# EAGLE design eeprom (EAGLE 7.5.0)
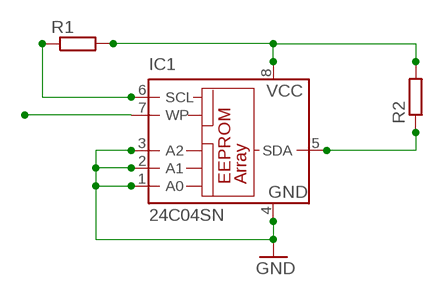
[diagram p0: schematic, sheet 1]

## Parts
IC1  24C04SN  [SO-08]
R1  R-EU_R2012W  [R2012W]
R2  R-EU_R2012W  [R2012W]

## Nets
GND: IC1.1(A0) IC1.2(A1) IC1.3(A2) IC1.4(GND)
N$1: IC1.8(VCC) R1.2 R2.2
N$2: IC1.6(SCL) R1.1
N$3: IC1.5(SDA) R2.1
N$4: IC1.7(WP)

## Library data of the parts
IC1 = microchip:24C*: Serial EEPROM 1 K/2 K/4 K; MPN: M24C04-WMN6P; OC_FARNELL: 9882812; OC_NEWARK: 83K1376
R1 R2 = resistor:R-EU_: RESISTOR, European symbol

## Board
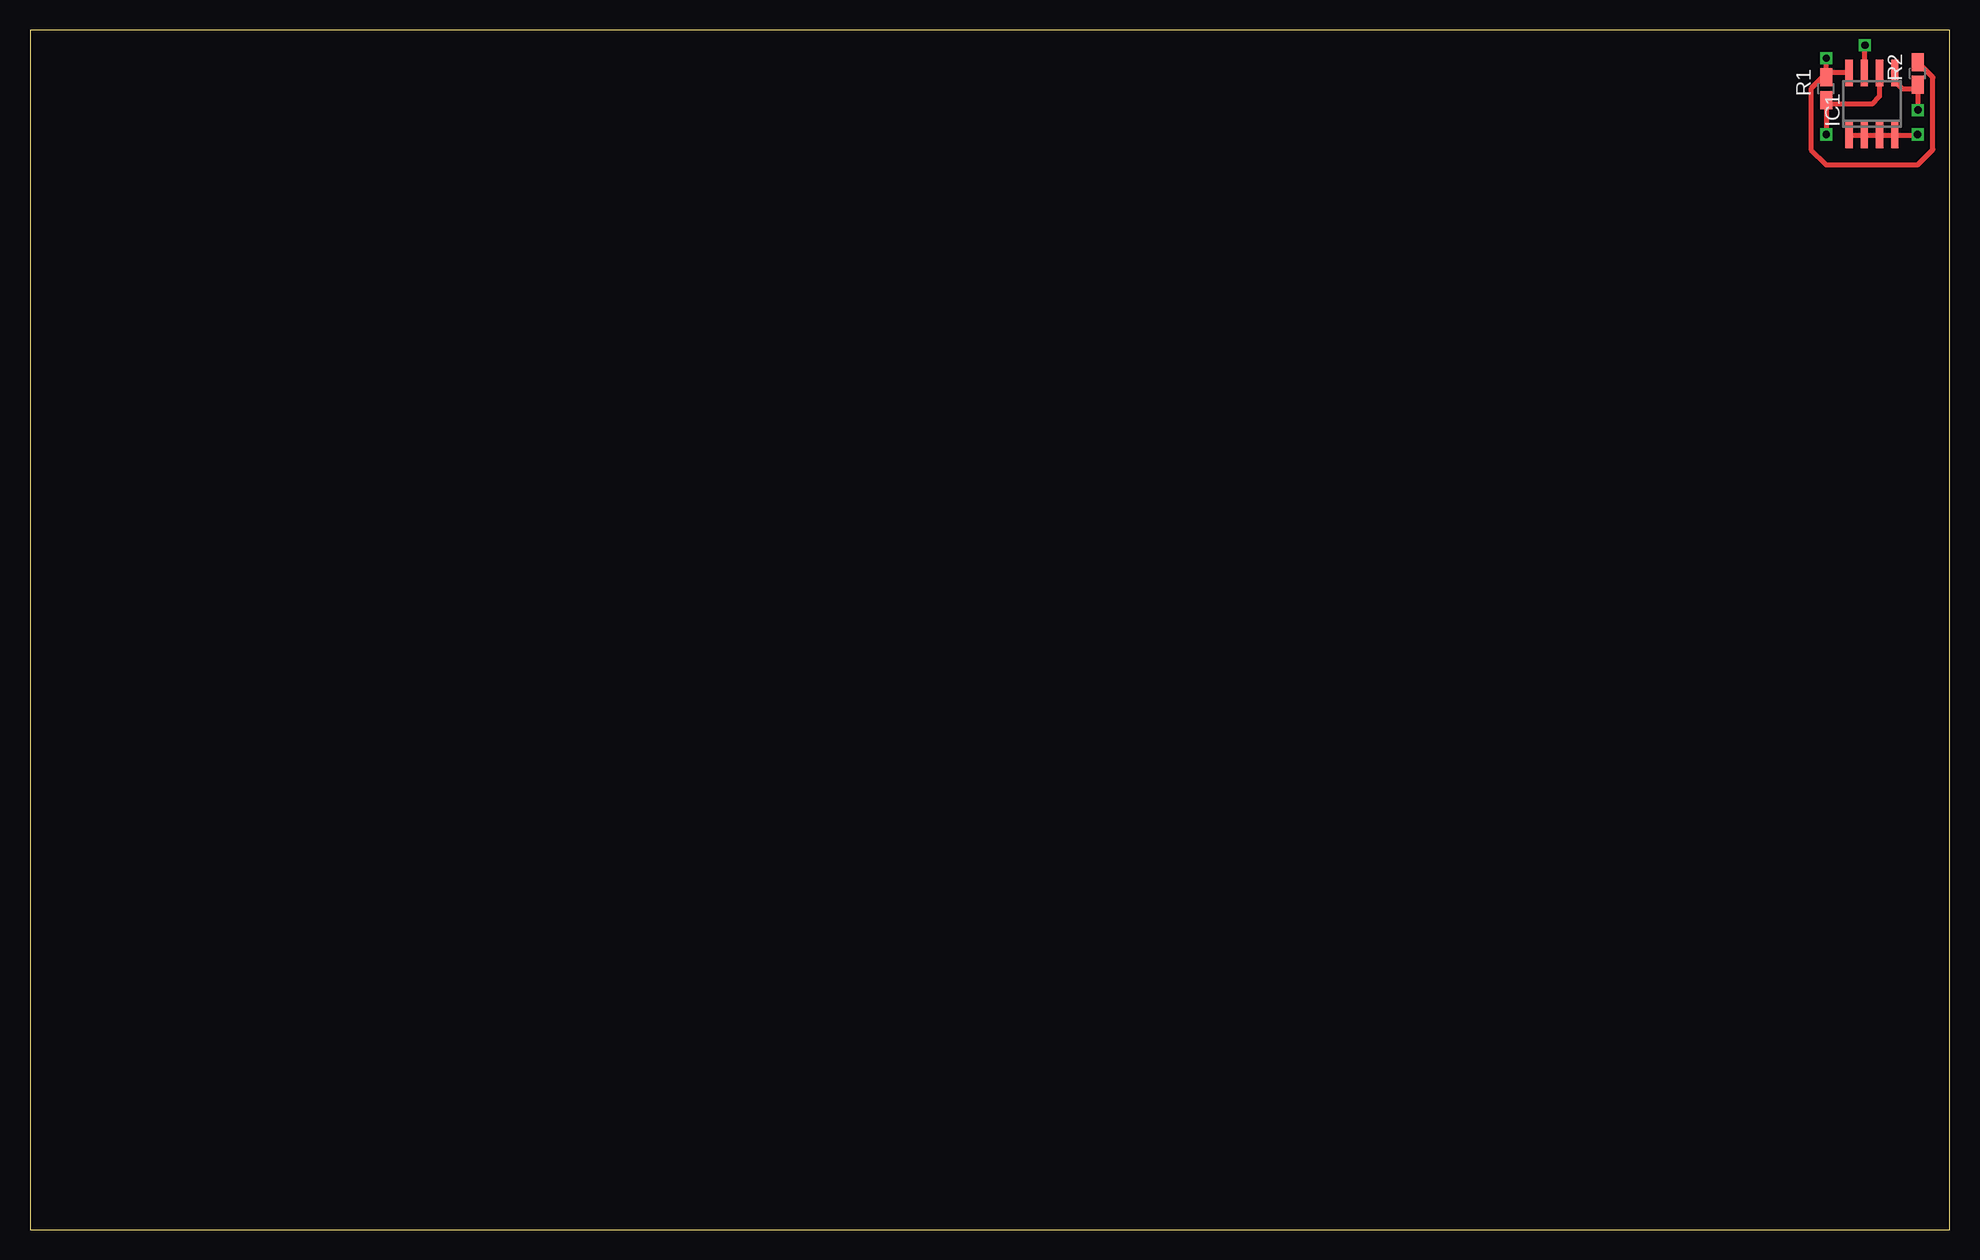
[diagram p1: board, top side]

Size 160 x 100 mm. Coordinates in mm from the lower left corner, seen from the top.
Outline: 0,0 160,0 160,100 0,100 0,0
Copper layers (1*16): Top 0.035mm / dielectric 1.5mm / Bottom 0.035mm
Design rules "default": minimum track width 10mil, minimum drill 24mil, track to track 8mil, track to pad 8mil, pad to pad 8mil, via to via 8mil, smd to smd 8mil, copper to edge 40mil, drill to drill 8mil, minimum pad ring 10mil, minimum via ring 8mil, stop-mask expansion 4mil, vias tented up to drill 0mil, thermal gap 10mil

### Footprints (pad centres in the part's own frame; a part is rotated, then mirrored left to right if it is on the bottom)
SO-08 = smd 0.6 x 2.2: 1 -1.905,-2.6; 2 -0.635,-2.6; 3 0.635,-2.6; 4 1.905,-2.6; 5 1.905,2.6; 6 0.635,2.6; 7 -0.635,2.6; 8 -1.905,2.6
R2012W = smd 1.5 x 1: 1 -0.94,0; 2 0.94,0

### Placement (x,y rotation side)
IC1  153.53,93.83 0 top
R1  149.72,95.1 90 top
R2  157.34,96.37 90 top

### Tracks (layer width: path | path; a pad name or v marks a point on that pad's centre or on a via)
GND  (via drill 0.6)
  Top 0.406: IC1.1 IC1.2 IC1.3 IC1.4 157.28,91.23 v157.34,91.29
N$1  (via drill 0.6)
  Top 0.406: R1.2 v149.72,97.64 | R1.2 149.39,96.04 148.45,95.1 148.45,90.02 149.72,88.75 157.34,88.75 158.61,90.02 158.61,96.04 R2.2 | IC1.8 150.11,96.43 R1.2
N$2  (via drill 0.6)
  Top 0.406: v149.72,91.29 R1.1 150.05,93.83 153.53,93.83 154.16,94.47 IC1.6
N$3  (via drill 0.6)
  Top 0.406: IC1.5 155.43,95.74 156.07,95.1 157.01,95.1 R2.1 v157.37,93.33
N$5  (via drill 0.6)
  other vias: 152.95,98.72
N$6
  Top 0.406: 152.93,96.61 152.94,96.61 152.94,98.72